# EAGLE design DisplayTestBoard (EAGLE 9.3.0)
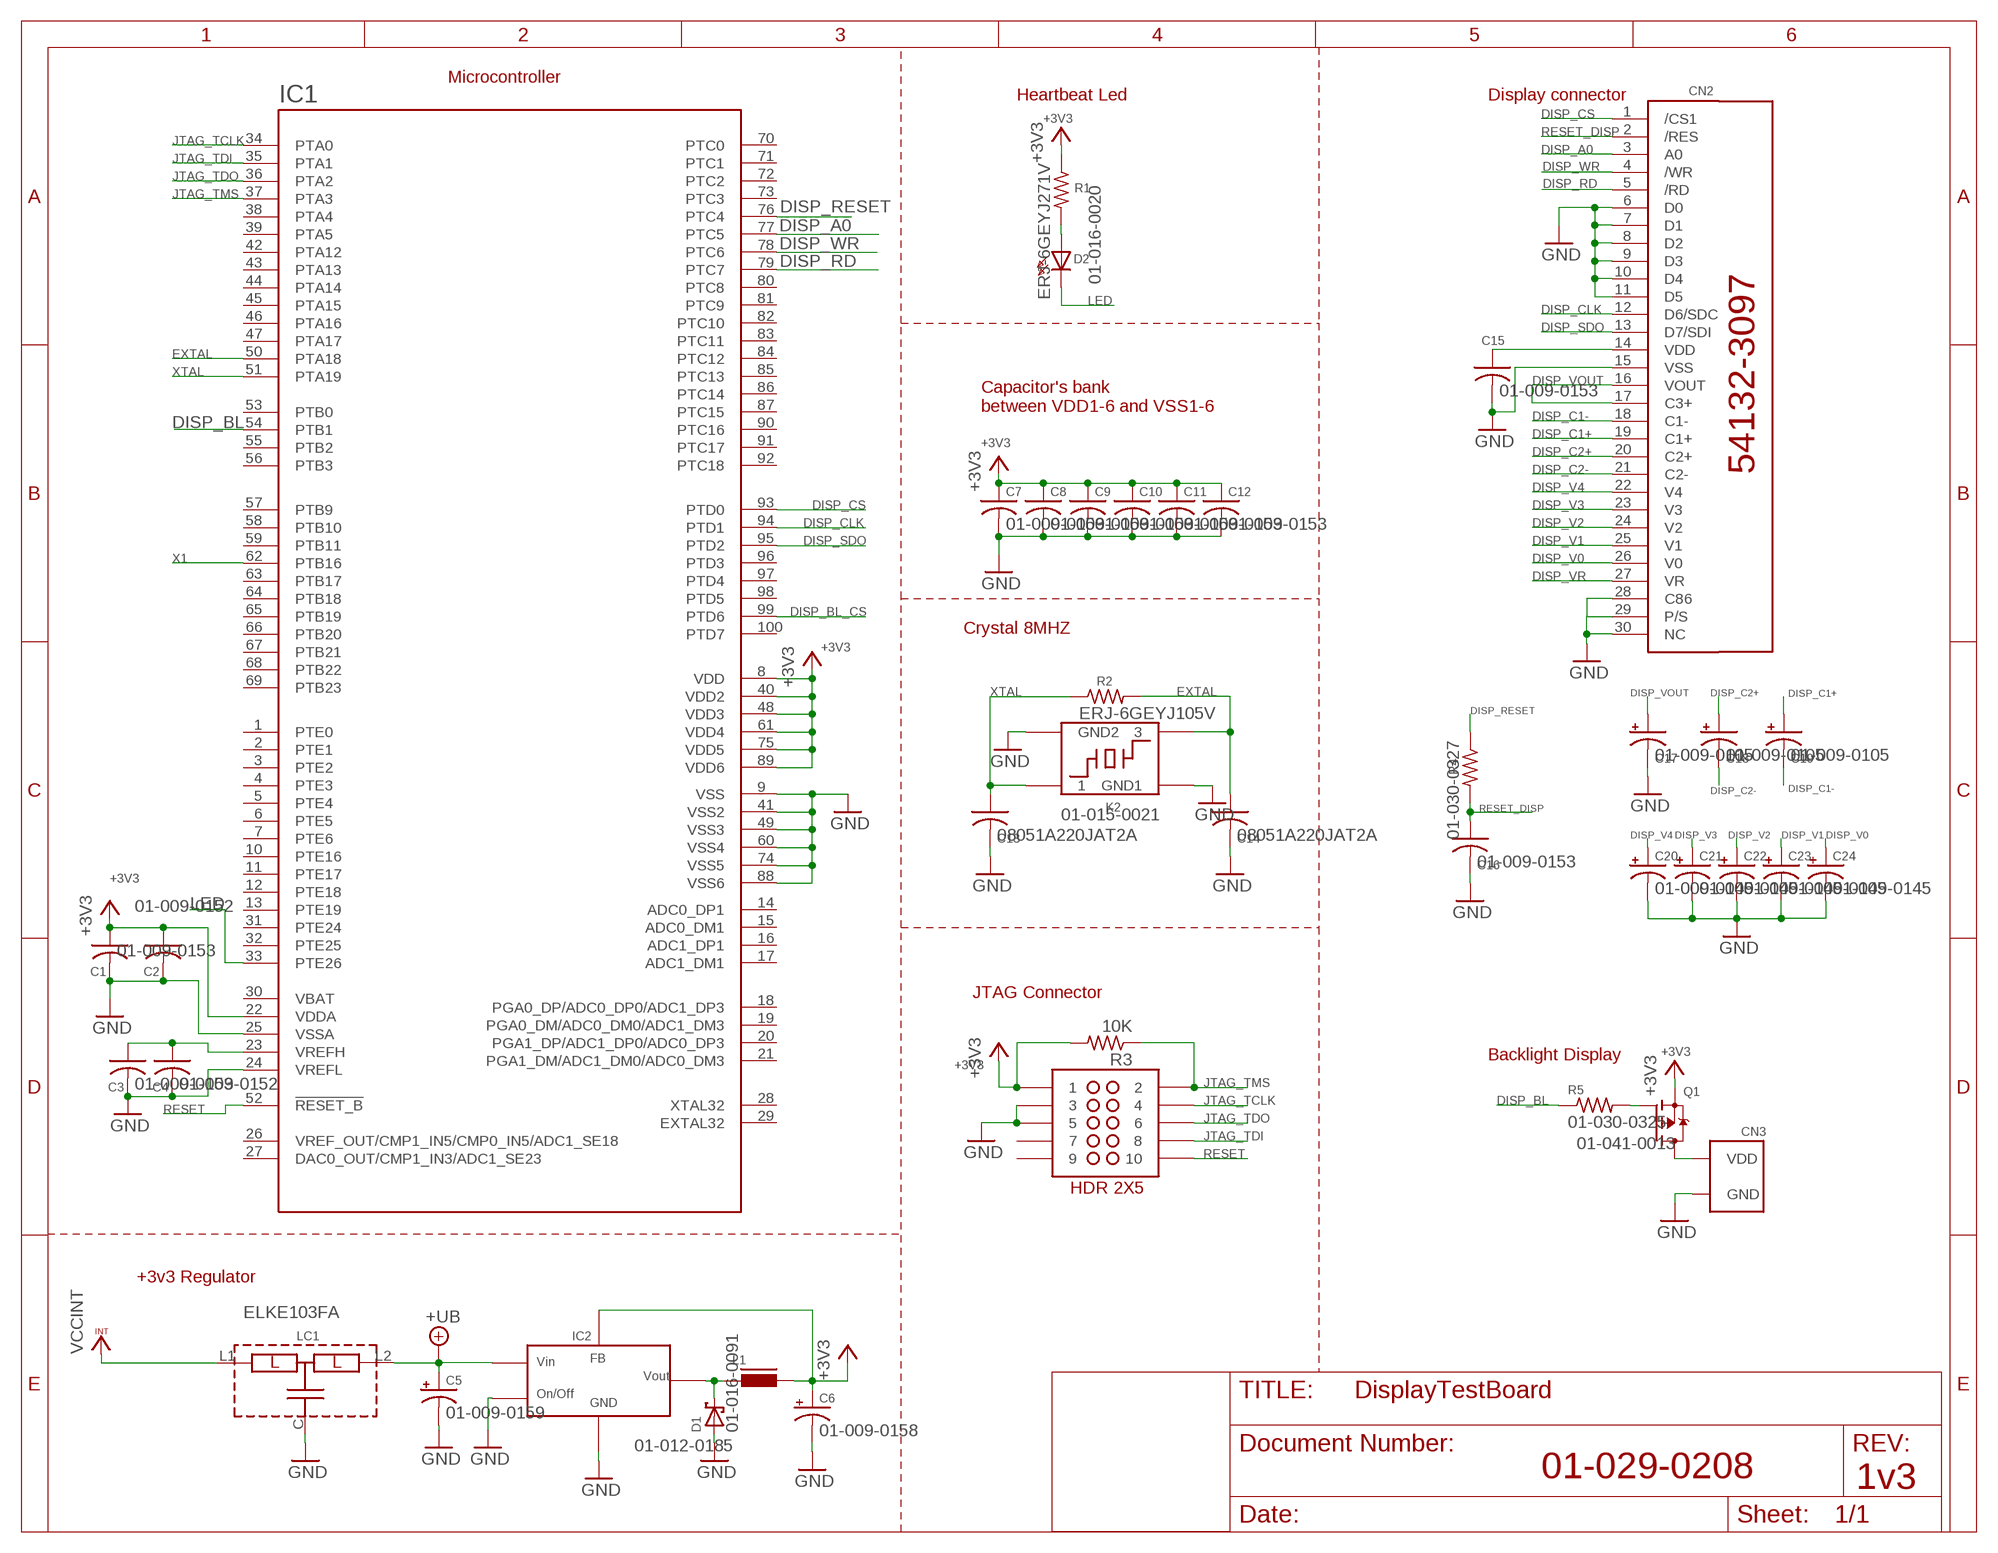
[diagram p0: schematic, sheet 1]

## Parts
C1  01-009-0153  [C0805]
C2  01-009-0152  [C0805]
C3  01-009-0153  [C0805]
C4  01-009-0152  [C0805]
C5  01-009-0159  [PANASONIC_6.3MM]
C6  01-009-0158  [PANASONIC_6.3MM]
C7  01-009-0153  [C0805]
C8  01-009-0153  [C0805]
C9  01-009-0153  [C0805]
C10  01-009-0153  [C0805]
C11  01-009-0153  [C0805]
C12  01-009-0153  [C0805]
C13  08051A220JAT2A  [C0805]
C14  08051A220JAT2A  [C0805]
C15  01-009-0153  [C0805]
C16  01-009-0153  [C0805]
C17  01-009-0105  [CT3528]
C18  01-009-0105  [CT3528]
C19  01-009-0105  [CT3528]
C20  01-009-0145  [CT3528]
C21  01-009-0145  [CT3528]
C22  01-009-0145  [CT3528]
C23  01-009-0145  [CT3528]
C24  01-009-0145  [CT3528]
CN2  01-014-0371  [XF2L-3035-1]
CN3  01-014-0372  [S2B-PH-K-S]
D1  01-016-0091  [SOD123]
D2  01-016-0020  [LED0603]
IC1  01-012-0181  [LQFP100]
IC2  01-012-0185  [SO08]
JTAG  SAMTECSTR2X5  [SAMTECSTR2X5]
K2  01-015-0021  [XTAL]
L1  01-023-0014  [SRR1260]
LC1  ELKE103FA  [ELKE103FA]
Q1  01-041-0013  [SOT-23]
R1  ERJ-6GEYJ271V  [M0805]
R2  ERJ-6GEYJ105V  [M0805]
R3  10K  01-030-0334  [M0805]
R4  01-030-0327  [M0805]
R5  01-030-0325  [M0805]

## Nets
+3V3: C1.1 C2.1 C3.1 C4.1 C6.+ C7.1 C8.1 C9.1 C10.1 C11.1 C12.1 C15.1 CN2.14(VDD) IC1.8(VDD) IC1.22(VDDA) IC1.23(VREFH) IC1.40(VDD2) IC1.48(VDD3) IC1.61(VDD4) IC1.75(VDD5) IC1.89(VDD6) IC2.4(FB) JTAG.P$1 L1.2 Q1.2(S) R1.1 R3.2
DISP_A0: CN2.3(A0) IC1.77(PTC5)
DISP_BL: IC1.54(PTB1) R5.1
DISP_BL_CS: IC1.99(PTD6)
DISP_C1+: C19.+ CN2.19(C1+)
DISP_C1-: C19.- CN2.18(C1-)
DISP_C2+: C18.+ CN2.20(C2+)
DISP_C2-: C18.- CN2.21(C2-)
DISP_CLK: CN2.12(D6/SDC) IC1.94(PTD1)
DISP_CS: CN2.1(/CS1) IC1.93(PTD0)
DISP_RD: CN2.5(/RD) IC1.79(PTC7)
DISP_RESET: IC1.76(PTC4) R4.1
DISP_SDO: CN2.13(D7/SDI) IC1.95(PTD2)
DISP_V0: C24.+ CN2.26(V0)
DISP_V1: C23.+ CN2.25(V1)
DISP_V2: C22.+ CN2.24(V2)
DISP_V3: C21.+ CN2.23(V3)
DISP_V4: C20.+ CN2.22(V4)
DISP_VOUT: C17.+ CN2.16(VOUT) CN2.17(C3+)
DISP_VR: CN2.27(VR)
DISP_WR: CN2.4(/WR) IC1.78(PTC6)
EXTAL: C14.1 IC1.50(PTA18) K2.P$3 R2.2
GND: C1.2 C2.2 C3.2 C4.2 C5.- C6.- C7.2 C8.2 C9.2 C10.2 C11.2 C12.2 C13.2 C14.2 C15.2 C16.2 C17.- C20.- C21.- C22.- C23.- C24.- CN2.6(D0) CN2.7(D1) CN2.8(D2) CN2.9(D3) CN2.10(D4) CN2.11(D5) CN2.15(VSS) CN2.28(C86) CN2.29(P/S) CN2.30(NC) CN3.GND D1.A IC1.9(VSS) IC1.24(VREFL) IC1.25(VSSA) IC1.41(VSS2) IC1.49(VSS3) IC1.60(VSS4) IC1.74(VSS5) IC1.88(VSS6) IC2.5(ON/OFF) IC2.6(GND) JTAG.P$2 JTAG.P$3 K2.P$2(GND1) K2.P$4(GND2) LC1.C
JTAG_TCLK: IC1.34(PTA0) JTAG.P$7
JTAG_TDI: IC1.35(PTA1) JTAG.P$9
JTAG_TDO: IC1.36(PTA2) JTAG.P$8
JTAG_TMS: IC1.37(PTA3) JTAG.P$6 R3.1
LED: D2.K(C) IC1.33(PTE26)
N$21: D1.C IC2.8(VOUT) L1.1
N$26: CN3.VDD Q1.3(D)
N$29: Q1.1(G) R5.2
N$31: D2.A R1.2
RESET: IC1.52(!RESET_B) JTAG.P$10
RESET_DISP: C16.1 CN2.2(/RES) R4.2
VCCINT: LC1.L1
VMAIN: C5.+ IC2.7(VIN) LC1.L2 ; supply symbol labelled +UB
X1: IC1.62(PTB16)
XTAL: C13.1 IC1.51(PTA19) K2.P$1 R2.1
Unconnected: IC1.1(PTE0) IC1.2(PTE1) IC1.3(PTE2) IC1.4(PTE3) IC1.5(PTE4) IC1.6(PTE5) IC1.7(PTE6) IC1.10(PTE16) IC1.11(PTE17) IC1.12(PTE18) IC1.13(PTE19) IC1.14(ADC0_DP1) IC1.15(ADC0_DM1) IC1.16(ADC1_DP1) IC1.17(ADC1_DM1) IC1.18(PGA0_DP/ADC0_DP0/ADC1_DP3) IC1.19(PGA0_DM/ADC0_DM0/ADC1_DM3) IC1.20(PGA1_DP/ADC1_DP0/ADC0_DP3) IC1.21(PGA1_DM/ADC1_DM0/ADC0_DM3) IC1.26(VREF_OUT/CMP1_IN5/CMP0_IN5/ADC1_SE18) IC1.27(DAC0_OUT/CMP1_IN3/ADC1_SE23) IC1.28(XTAL32) IC1.29(EXTAL32) IC1.30(VBAT) IC1.31(PTE24) IC1.32(PTE25) IC1.38(PTA4) IC1.39(PTA5) IC1.42(PTA12) IC1.43(PTA13) IC1.44(PTA14) IC1.45(PTA15) IC1.46(PTA16) IC1.47(PTA17) IC1.53(PTB0) IC1.55(PTB2) IC1.56(PTB3) IC1.57(PTB9) IC1.58(PTB10) IC1.59(PTB11) IC1.63(PTB17) IC1.64(PTB18) IC1.65(PTB19) IC1.66(PTB20) IC1.67(PTB21) IC1.68(PTB22) IC1.69(PTB23) IC1.70(PTC0) IC1.71(PTC1) IC1.72(PTC2) IC1.73(PTC3) IC1.80(PTC8) IC1.81(PTC9) IC1.82(PTC10) IC1.83(PTC11) IC1.84(PTC12) IC1.85(PTC13) IC1.86(PTC14) IC1.87(PTC15) IC1.90(PTC16) IC1.91(PTC17) IC1.92(PTC18) IC1.96(PTD3) IC1.97(PTD4) IC1.98(PTD5) IC1.100(PTD7) JTAG.P$4 JTAG.P$5

## Notes on the sheet
- Microcontroller
- Heartbeat Led | Display connector
- Capacitor's bank
  between VDD1-6 and VSS1-6
- Crystal 8MHZ
- JTAG Connector
- Backlight Display
- +3v3 Regulator
- 01-029-0208
- 1v3

## Library data of the parts
C1 C3 C7-C12 C15 C16 = PegasusControl:01-009-0153: Capacitor Ceramico 0.1 uF 25V X7R 10% 0805 C0805C104K3RACTU http://www.kemet.com/docfinder?Partnumber=C0805C104K3RACTU
C2 C4 = PegasusControl:01-009-0152: Capacitor Ceramico 0.01 uF 25V X7R 10% 0805 C0805C103K3RACTU http://www.kemet.com/docfinder?Partnumber=C0805C103K3RACTU
C5 = PegasusControl:01-009-0159: Capacitor Ceramico 10 uF 50V UUD1H100MCL1GS http://nichicon-us.com/english/products/pdfs/e-ud.pdf
C6 = PegasusControl:01-009-0158: Capacitor Ceramico 100 uF 10V UUD1A101MCL1GS http://nichicon-us.com/english/products/pdfs/e-ud.pdf
C13 C14 = PegasusControl:08051A220JAT2A: Capacitor Ceramico 22pF 5% 100V 0805 SMD 08051A220JAT2A AVX Corporation
C17-C19 = PegasusControl:01-009-0105: Capacitor Tantalio 4.7uF 10V 10% SMD CT3528
C20-C24 = PegasusControl:01-009-0145: Capacitor Tantalio 1uF 35V 20% SMD TAJA105M035RNJ AVX Corporation
CN2 = PegasusControl:01-014-0371: Conector Display Grafico Kyosera F-55472GNFJ-SLW-AAN 54132-3097 Molex
CN3 = PegasusControl:01-014-0372: CONN HEADER PTH SIDE 2POS 2MM S2B-PH-K-S JST Sales America
D1 = PegasusControl:01-016-0091: Diode Schottky Power Rectifier 40V 0.5A MBR0540T1G http://www.onsemi.com/pub_link/Collateral/MBR0540T1-D.PDF
D2 = PegasusControl:01-016-0020: Led Green 1.6x0.8mm 0603 SMD XZMG53W-1 SUNLED
IC1 = PegasusControl:01-012-0181: Microcontrolador Kinetis MK10 Microcontrolador Kinetis MK10DX256VLL7 LQFP100
IC2 = PegasusControl:01-012-0185: Switching Regulator 3.3v LM2594MX-3.3/NOPB http://www.ti.com/lit/ds/symlink/lm2594.pdf
JTAG = troyaIII:SAMTECSTR2X5
K2 = PegasusControl:01-015-0021: Cristal 8MHZ 18PF SMD 7B-8.000MAAJ-T TXC CORPORATION http://www.txccrystal.com/images/pdf/7b.pdf
L1 = PegasusControl:01-023-0014: Inductor Power 390uH 1.08A SMD SRR1260-391K http://www.bourns.com/data/global/pdfs/SRR1260.pdf
LC1 = PegasusControl:ELKE103FA: EMI Filter 500 KHz 10,000 pF 50V 2.0 A 1207 SMD ELKE103FA Panasonic
Q1 = PegasusControl:01-041-0013: Mosfet P-Channel 20V 3.7A SOT23 SMD IRLML6402TRPBF International Rectifier
R1 = PegasusControl:ERJ-6GEYJ271V: Res 270 Ohm 1/8W 5% 0805 SMD ERJ-6GEYJ271V Panasonic
R2 = PegasusControl:ERJ-6GEYJ105V: Res 1M Ohm 1/8W 5% 0805 SMD ERJ-6GEYJ105V Panasonic
R3 = PegasusControl:01-030-0334: Res 10K Ohm 1/8W 5% 0805 SMD ERJ-6GEYJ103V
R4 = PegasusControl:01-030-0327: Res 4.7K Ohm 1/8W 5% 0805 Resistencia 4.7K Ohm 1/8W 5% 0805 ERJ-6GEYJ472V http://industrial.panasonic.com/www-cgi/jvcr13pz.cgi?E+PZ+3+AOA0001+ERJ6GEYJ472V+7+WW
R5 = PegasusControl:01-030-0325: Res 1K Ohm 1/4W 5% Resistencia 1K Ohm 1/4W 5% 0805 ERJ-6GEYJ102V http://industrial.panasonic.com/www-cgi/jvcr13pz.cgi?E+PZ+3+AOA0001+ERJ6GEYJ102V+7+WW

## Board
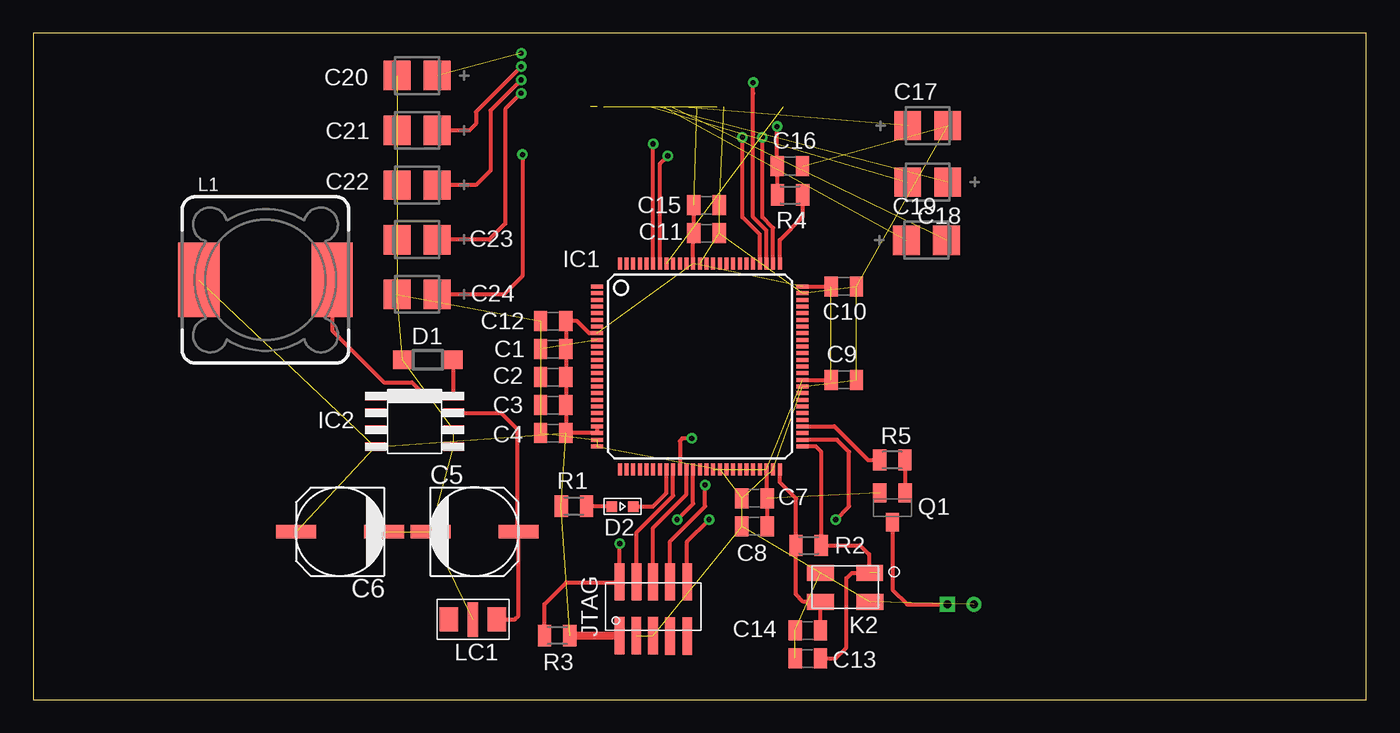
[diagram p1: board, top side]
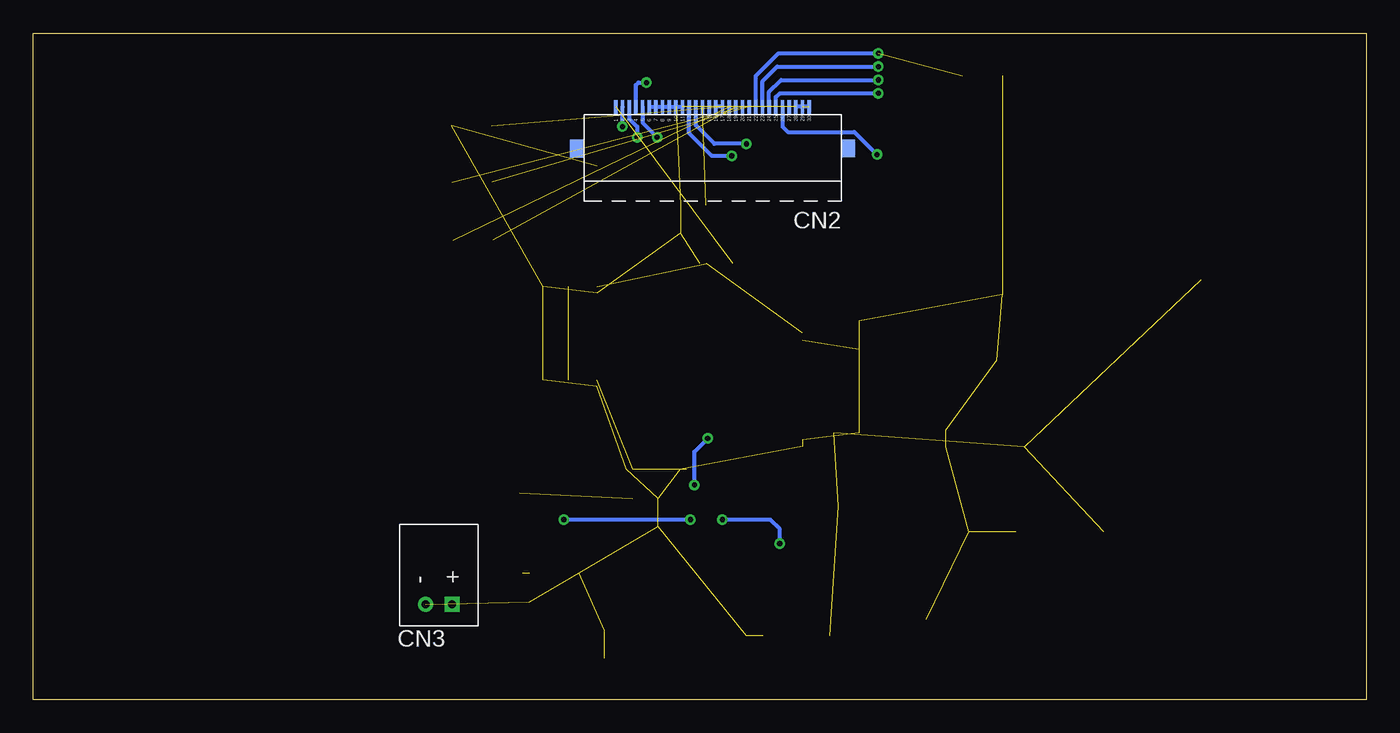
[diagram p2: board, bottom side, seen from below]

Size 100 x 50 mm. Coordinates in mm from the lower left corner, seen from the top.
Outline: 0,0 100,0 100,50 0,50 0,0
Copper layers (1*16): Top 0.035mm / dielectric 1.5mm / Bottom 0.035mm
Design rules "default": minimum track width 6mil, minimum drill 0.35mm, track to track 6mil, track to pad 6mil, pad to pad 6mil, via to via 6mil, smd to smd 6mil, copper to edge 40mil, drill to drill 6mil, minimum pad ring 10mil, minimum via ring 8mil, stop-mask expansion 4mil, vias tented up to drill 0mil, thermal gap 10mil

### Footprints (pad centres in the part's own frame; a part is rotated, then mirrored left to right if it is on the bottom)
C0805 = smd 1 x 1.5: 1 -0.95,0; 2 0.95,0
PANASONIC_6.3MM = smd 3 x 1: + 3.3,0; - -3.3,0
CT3528 = smd 2 x 2.2: + -1.5,0; - 1.5,0
XF2L-3035-1 = smd 1 x 0.25: 1 7.09,16.92; 2 7.09,16.42; 3 7.09,15.92; 4 7.09,15.42; 5 7.09,14.92; 6 7.09,14.42; 7 7.09,13.92; 8 7.09,13.42; 9 7.09,12.92; 10 7.09,12.42; 11 7.09,11.92; 12 7.09,11.42; 13 7.09,10.92; 14 7.09,10.42; 15 7.09,9.92; 16 7.09,9.42; 17 7.09,8.92; 18 7.09,8.42; 19 7.09,7.92; 20 7.09,7.42; 21 7.09,6.92; 22 7.09,6.42; 23 7.09,5.92; 24 7.09,5.42; 25 7.09,4.92; 26 7.09,4.42; 27 7.09,3.92; 28 7.09,3.42; 29 7.09,2.92; 30 7.09,2.42 | smd 1.34 x 1: M1 3.975,-0.502; M3 3.965,19.878
S2B-PH-K-S = drill 0.61: GND 1.6,3.95 | drill 0.61 square: VDD 1.6,1.95
SOD123 = smd 1.4 x 1.4: A 1.9,0; C -1.9,0
LED0603 = smd 0.8 x 0.8: A -0.8,0; K 0.8,0
LQFP100 = smd 0.9 x 0.3: 1 -7.72,6; 2 -7.72,5.5; 3 -7.72,5; 4 -7.72,4.5; 5 -7.72,4; 6 -7.72,3.5; 7 -7.72,3; 8 -7.72,2.5; 9 -7.72,2; 10 -7.72,1.5; 11 -7.72,1; 12 -7.72,0.5; 13 -7.72,0; 14 -7.72,-0.5; 15 -7.72,-1; 16 -7.72,-1.5; 17 -7.72,-2; 18 -7.72,-2.5; 19 -7.72,-3; 20 -7.72,-3.5; 21 -7.72,-4; 22 -7.72,-4.5; 23 -7.72,-5; 24 -7.72,-5.5; 25 -7.72,-6; 51 7.72,-6; 52 7.72,-5.5; 53 7.72,-5; 54 7.72,-4.5; 55 7.72,-4; 56 7.72,-3.5; 57 7.72,-3; 58 7.72,-2.5; 59 7.72,-2; 60 7.72,-1.5; 61 7.72,-1; 62 7.72,-0.5; 63 7.72,0; 64 7.72,0.5; 65 7.72,1; 66 7.72,1.5; 67 7.72,2; 68 7.72,2.5; 69 7.72,3; 70 7.72,3.5; 71 7.72,4; 72 7.72,4.5; 73 7.72,5; 74 7.72,5.5; 75 7.72,6 | smd 0.3 x 0.9: 26 -6,-7.72; 27 -5.5,-7.72; 28 -5,-7.72; 29 -4.5,-7.72; 30 -4,-7.72; 31 -3.5,-7.72; 32 -3,-7.72; 33 -2.5,-7.72; 34 -2,-7.72; 35 -1.5,-7.72; 36 -1,-7.72; 37 -0.5,-7.72; 38 0,-7.72; 39 0.5,-7.72; 40 1,-7.72; 41 1.5,-7.72; 42 2,-7.72; 43 2.5,-7.72; 44 3,-7.72; 45 3.5,-7.72; 46 4,-7.72; 47 4.5,-7.72; 48 5,-7.72; 49 5.5,-7.72; 50 6,-7.72; 76 6,7.72; 77 5.5,7.72; 78 5,7.72; 79 4.5,7.72; 80 4,7.72; 81 3.5,7.72; 82 3,7.72; 83 2.5,7.72; 84 2,7.72; 85 1.5,7.72; 86 1,7.72; 87 0.5,7.72; 88 0,7.72; 89 -0.5,7.72; 90 -1,7.72; 91 -1.5,7.72; 92 -2,7.72; 93 -2.5,7.72; 94 -3,7.72; 95 -3.5,7.72; 96 -4,7.72; 97 -4.5,7.72; 98 -5,7.72; 99 -5.5,7.72; 100 -6,7.72
SO08 = smd 1.54 x 0.635: 1 -2.948,1.778; 2 -2.948,0.508; 3 -2.948,-0.762; 4 -2.948,-2.032; 5 2.948,-2.032; 6 2.948,-0.762; 7 2.948,0.508; 8 2.948,1.778
SAMTECSTR2X5 = smd 0.74 x 2.79: P$1 1.28,1.4; P$2 2.54,1.4; P$3 3.8,1.4; P$4 5.08,1.36; P$5 6.36,1.36; P$6 1.28,5.44; P$7 2.56,5.44; P$8 3.8,5.44; P$9 5.08,5.44; P$10 6.36,5.44
XTAL = smd 2 x 1.2: P$1 0.65,0.51; P$2 4.35,0.51; P$3 4.36,2.68; P$4 0.64,2.69
SRR1260 = smd 5.6 x 3.1: 1 0,5; 2 0,-5
ELKE103FA = smd 0.8 x 2.6: C 0,0 | smd 1.4 x 1.8: L1 -1.8,0; L2 1.8,0
SOT-23 = smd 1 x 1.4: 1 -0.95,-1.1; 2 0.95,-1.1; 3 0,1.1
M0805 = smd 1 x 1.6: 1 -0.95,0; 2 0.95,0

### Placement (x,y rotation side)
C1  39,26.3 180 top
C2  39,24.2 180 top
C3  39,22.1 180 top
C4  39,20 180 top
C5  33.1,12.6 0 top
C6  23,12.6 180 top
C7  54.1,15.1 180 top
C8  54.1,13 180 top
C9  60.8,24 0 top
C10  60.8,31 0 top
C11  50.5,35 0 top
C12  39,28.4 180 top
C13  58.1,3.09 180 top
C14  58.11,5.19 180 top
C15  50.5,37.1 0 top
C16  56.75,40.03 0 top
C17  67.11,43.07 0 top
C18  67.09,38.83 180 top
C19  67.01,34.47 0 top
C20  28.79,46.83 180 top
C21  28.79,42.71 180 top
C22  28.79,38.61 180 top
C23  28.79,34.51 180 top
C24  28.79,30.41 180 top
CN2  39.37,37.39 90 bottom
CN3  66.63,5.53 90 bottom
D1  29.6,25.5 180 top
D2  44.21,14.48 0 top
IC1  50,25 0 top
IC2  28.6,21 0 top
JTAG  42.7,3.4 0 top
K2  63.41,10.03 180 top
L1  17.42,31.49 270 top
LC1  32.98,6.01 0 top
Q1  64.46,14.41 180 top
R1  40.55,14.51 0 top
R2  58.17,11.57 180 top
R3  39.3,4.8 0 top
R4  56.78,37.87 180 top
R5  64.44,17.98 0 top

### Tracks (layer width: path | path; a pad name or v marks a point on that pad's centre or on a via)
+3V3  (12 unrouted)
  Top 0.305: IC1.22 IC1.23 C4.1 C3.1 C2.1 C1.1 C12.1 40.8,28.4 41.7,27.5 IC1.8 | IC1.75 C10.1 | IC1.61 C9.1 | IC1.48 55,15.15 C7.1 C8.1 | IC1.89 49.5,34.95 C11.1 C15.1
  Top 0.61: JTAG.P$1 R3.2
DISP_A0  (via drill 0.38)
  Top 0.305: IC1.77 55.5,35.4 54.7,36.2 v54.7,42.2
  Bottom 0.305: CN2.3 55.29,43.59 54.7,43 v54.7,42.2
DISP_BL
  Top 0.305: IC1.54 60.1,20.5 62.62,17.98 R5.1
DISP_C1+  (1 unrouted)
DISP_C1-  (1 unrouted)
DISP_C2+  (1 unrouted)
DISP_C2-  (1 unrouted)
DISP_CLK  (via drill 0.38)
  Top 0.305: IC1.94 47,40.2 v47.6,40.8
  Bottom 0.305: v47.6,40.8 49.1,40.8 50.8,42.5 50.79,42.51 CN2.12
DISP_CS  (1 unrouted)
DISP_RD  (via drill 0.38)
  Top 0.305: IC1.79 54.5,34.9 53.2,36.2 v53.2,42.2
  Bottom 0.305: CN2.5 54.29,43.29 v53.2,42.2
DISP_RESET
  Top 0.305: IC1.76 56,34.5 57.73,36.23 R4.1
DISP_SDO  (via drill 0.38)
  Top 0.305: IC1.95 v46.5,41.7
  Bottom 0.305: v46.5,41.7 48.9,41.7 50.3,43.1 50.29,43.11 CN2.13
DISP_V0  (via drill 0.38)
  Top 0.305: v36.7,40.9 36.7,31.8 35.3,30.4 35.29,30.41 C24.+
  Bottom 0.305: CN2.26 43.79,42.99 43.4,42.6 38.4,42.6 v36.7,40.9
DISP_V1  (via drill 0.38)
  Top 0.305: v36.6,45.5 35.4,44.3 35.4,35.7 34.21,34.51 C23.+
  Bottom 0.305: CN2.25 44.29,45.21 44,45.5 v36.6,45.5
DISP_V2  (via drill 0.38)
  Top 0.305: v36.6,46.5 34.3,44.2 34.3,39.7 33.21,38.61 C22.+
  Bottom 0.305: CN2.24 44.79,45.61 43.9,46.5 v36.6,46.5
DISP_V3  (via drill 0.38)
  Top 0.305: v36.6,47.5 33.2,44.1 33.2,43.2 32.71,42.71 C21.+
  Bottom 0.305: CN2.23 45.29,46.41 44.2,47.5 v36.6,47.5
DISP_V4  (via drill 0.38)  (1 unrouted)
  Bottom 0.305: CN2.22 45.79,46.81 44.1,48.5 v36.6,48.5
DISP_VOUT  (1 unrouted)
  Bottom 0.305: CN2.17 CN2.16
DISP_WR  (via drill 0.38)
  Top 0.305: IC1.78 55,35.2 54,36.2 54,42.4 | 54,42.4 | 54,42.4 54,45.5 v54,46.3
  Bottom 0.305: CN2.4 54.79,46.11 54.6,46.3 v54,46.3
EXTAL
  Top 0.305: C14.1 K2.P$3 57.75,7.35 57.2,7.9 57.2,11.55 R2.2 57.22,15.08 56,16.3 IC1.50
GND  (42 unrouted)
  Bottom 0.305: CN2.30 CN2.28 | CN2.6 CN2.7 CN2.8 CN2.9 CN2.10 CN2.11
JTAG_TCLK
  Top 0.305: JTAG.P$7 45.26,12.56 48,15.3 IC1.34
JTAG_TDI  (via drill 0.38)
  Top 0.305: JTAG.P$9 47.78,11.88 50.4,14.5 v50.4,16.1 | v49.4,19.6 48.7,19.6 48.5,19.4 IC1.35
  Bottom 0.305: v50.4,16.1 50.4,18.6 v49.4,19.6
JTAG_TDO
  Top 0.305: JTAG.P$8 46.5,12.9 49,15.4 IC1.36
JTAG_TMS  (via drill 0.38)
  Top 0.305: R3.1 38.35,7.15 40,8.8 43.94,8.8 JTAG.P$6 43.98,11.68 v44,11.7 | v48.3,13.5 49.5,14.7 IC1.37
  Bottom 0.305: v44,11.7 44,12.8 44.7,13.5 v48.3,13.5
LED
  Top 0.305: D2.K 46.48,14.48 47.5,15.5 IC1.33
N$21
  Top 0.305: D1.C 31.55,25.45 IC2.8 29.42,22.78 28.4,23.8 26.3,23.8 22.42,27.68 L1.1
N$26
  Top 0.305: Q1.3 64.46,8.24 65.57,7.13 CN3.VDD
N$29
  Top 0.305: R5.2 65.41,17.96 Q1.1
N$31
  Top 0.305: D2.A 43.38,14.51 R1.2
RESET  (via drill 0.38)
  Top 0.305: JTAG.P$10 49.06,11.86 v50.7,13.5 | v60.2,13.5 61.2,14.5 61.2,18.6 60.3,19.5 IC1.52
  Bottom 0.305: v50.7,13.5 v60.2,13.5
RESET_DISP  (via drill 0.38)
  Top 0.305: R4.2 55.8,37.9 C16.1 v55.8,43
  Bottom 0.305: v55.8,43 CN2.2
VMAIN
  Top 0.305: IC2.7 35.09,21.51 36.3,20.3 36.3,12.7 C5.+ 36.4,6.3 36.11,6.01 LC1.L2
XTAL  (1 unrouted)
  Top 0.305: C13.1 60.19,3.09 61,3.9 61,9.1 61.4,9.5 63.3,9.5 | K2.P$1 62.7,9.58 62.7,10.9 62.03,11.57 R2.1 59.12,18.58 58.7,19 IC1.51